# Altium project 2015_PerfServos.PrjPCB
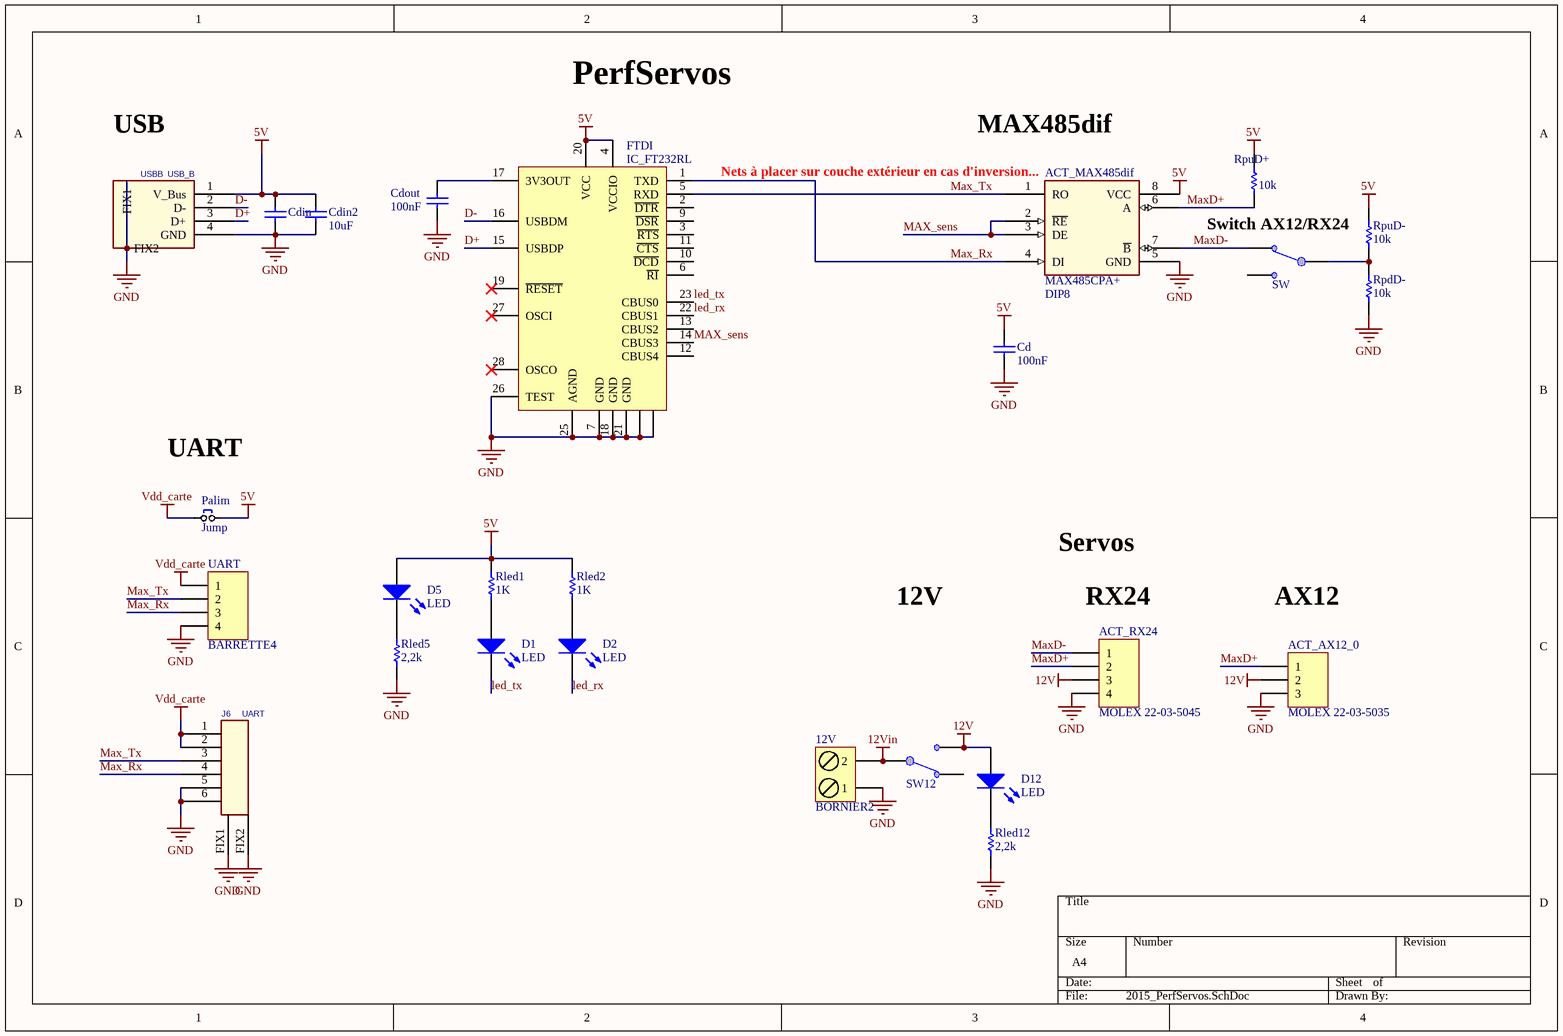
[diagram p0: 2015_PerfServos.SchDoc]
1 sheet, 26 parts. Net scope: global (net labels, ports and power ports of the same name join across sheets).
Board file: 2015_PerfServos.PcbDoc

## Sheet 2015_PerfServos.SchDoc
size A4

### Parts
12V  BORNIER2  [BORNIER_2V_5.08MM]
ACT_AX12_0  MOLEX 22-03-5035  [MOLEX3_2.5MM]
ACT_MAX485dif  Type: MAX485CPA+  Package: DIP8  [SO8_N]  (hidden comment: MAX485CPA+_DIP8)
ACT_RX24  MOLEX 22-03-5045  [MOLEX4_2.5MM]
Cd  100nF  [C0805_N]
Cdin  100nF  [C0603_N]  (value not drawn)
Cdin2  10uF  [C1206_N]
Cdout  100nF  [C0603_N]
D1  LED  [LED_0805]
D2  LED  [LED_0805]
D5  LED  [LED_0805]
D12  LED  [LED_0805]
FTDI  IC_FT232RL  [SSOP28_N]
J6  UART  [RJ11_6/6]
Palim  Jump  [HDR1X2]
Rled1  1K  [R1206_N]
Rled2  1K  [R1206_N]
Rled5  2,2k  [R1206_N]
Rled12  2,2k  [R1206_N]
RpdD-  10k  [R1206_N]
RpuD+  10k  [R1206_N]
RpuD-  10k  [R1206_N]
SW  (no value)  [SW_UNIPOL_DROIT - Ebay - SPDT - 11x6x5]
SW12  (no value)  [SW_UNIPOL_DROIT - Ebay - SPDT - 11x6x5]
UART  BARRETTE4  [HDR1X4]
USBB  USB_B  [USB_B_COUDE]

### Nets
5V: ACT_MAX485dif.8(VCC) Cd.2 Cdin.2 Cdin2.2 D5.1 FTDI.4(VCCIO) FTDI.20(VCC) Palim.2 Rled1.2 Rled2.2 RpuD+.2 RpuD-.1 USBB.1(V_Bus)
12V: ACT_AX12_0.2 ACT_RX24.3 D12.1 SW12.NO1
12Vin: 12V.2 SW12.COMMON1
GND: 12V.1 ACT_AX12_0.3 ACT_MAX485dif.5(GND) ACT_RX24.4 Cd.1 Cdin.1 Cdin2.1 Cdout.1 FTDI.7(GND) FTDI.8(NC) FTDI.18(GND) FTDI.21(GND) FTDI.24(NC) FTDI.25(AGND) FTDI.26(TEST) J6.5 J6.6 J6.FIX1 J6.FIX2 Rled5.1 Rled12.1 RpdD-.2 UART.4 USBB.4(GND) USBB.FIX1 USBB.FIX2
Vdd_carte: J6.1 J6.2 Palim.1 UART.1
D+: FTDI.15(USBDP) USBB.3(D+)
D-: FTDI.16(USBDM) USBB.2(D-)
led_rx: D2.2 FTDI.22(CBUS1)
led_tx: D1.2 FTDI.23(CBUS0)
Max_Rx: ACT_MAX485dif.4(DI) FTDI.1(TXD) J6.4 UART.3
MAX_sens: ACT_MAX485dif.2(~{RE}) ACT_MAX485dif.3(DE) FTDI.14(CBUS3)
Max_Tx: ACT_MAX485dif.1(RO) FTDI.5(RXD) J6.3 UART.2
MaxD+: ACT_AX12_0.1 ACT_MAX485dif.6(A) ACT_RX24.2 RpuD+.1
MaxD-: ACT_MAX485dif.7(~{B}) ACT_RX24.1 SW.NC1
NetCdout_2: Cdout.2 FTDI.17(3V3OUT)
NetD1_1: D1.1 Rled1.1
NetD2_1: D2.1 Rled2.1
NetD5_2: D5.2 Rled5.2
NetD12_2: D12.2 Rled12.2
NetRpdD-_1: RpdD-.1 RpuD-.2 SW.COMMON1

Not connected (* = marked no-connect by the designer): FTDI 2(~{DTR}) 3(~{RTS}) 6(~{RI}) 9(~{DSR}) 10(~{DCD}) 11(~{CTS}) 12(CBUS4) 13(CBUS2) 19(~{RESET})* 27(OSCI)* 28(OSCO)*; SW NO1; SW12 NC1

### Notes on the sheet
- PerfServos
- (near USBB) USB
- (near ACT_MAX485dif) Nets à placer sur couche extérieur en cas d'inversion...
- MAX485dif
- Switch AX12/RX24
- UART
- Servos
- 12V
- (near ACT_RX24) RX24
- AX12

### Library data of the parts
12V = BORNIER2: Terminal blocks, 2 pins, pitch=5mm
ACT_AX12_0 = BARRETTE3: Header, 3-Pin; LatestRevisionDate: 17-Jul-2002; LatestRevisionNote: Re-released for DXP Platform.; Publisher: Altium Limited
ACT_MAX485dif = MAX485CPA+_DIP8: EMETTEUR/RECEPTEUR FAIBLE PUISSANCE DE LIAISONS RS422/RS485 - DIP8
ACT_RX24 UART = BARRETTE4: Header, 4-Pin; LatestRevisionDate: 17-Jul-2002; LatestRevisionNote: Re-released for DXP Platform.; Publisher: Altium Limited
Cd = Condensateur: Capacitor; Published: 8-Jun-2000; LatestRevisionDate: 17-Jul-2002; LatestRevisionNote: Re-released for DXP Platform.; PackageReference: RAD-0.3; Publisher: Altium Limited
Cdin Cdout = Capacitor: FAR: 1740614; Published: 01/01/10; LatestRevisionDate: 17-Jul-2002; LatestRevisionNote: Re-released for DXP Platform.; Publisher: Damien GUITTON
Cdin2 = Capacitor: Published: 8-Jun-2000; LatestRevisionDate: 17-Jul-2002; LatestRevisionNote: Re-released for DXP Platform.; PackageReference: RAD-0.3; Publisher: Altium Limited
D1 D2 D5 D12 = LED: Typical LED; Published: 8-Jun-2000; LatestRevisionDate: 08-Jul-2005; LatestRevisionNote: Mech Layer 1 removed.; PackageReference: LED-1; Publisher: Altium Limited
FTDI = IC_FT232RL: FT232R USB UART; Manufacturer: *; Note: *; ManufacturerPartNo: *
J6 = CONNECTEUR_RJ12
Palim = Jumper SIP2.54
Rled1 Rled2 Rled5 Rled12 RpdD- RpuD+ RpuD- = Resistor: Published: 8-Jun-2000; LatestRevisionDate: 17-Jul-2002; LatestRevisionNote: Re-released for DXP Platform.; PackageReference: AXIAL-0.5; Publisher: Altium Limited
SW SW12 = SW SPDT- APEM Série 523x: Switch unipolaire a levier